# EasyEDA Pro project ProDoc_PCB1_2025-12-02.epro

# Board PCB1
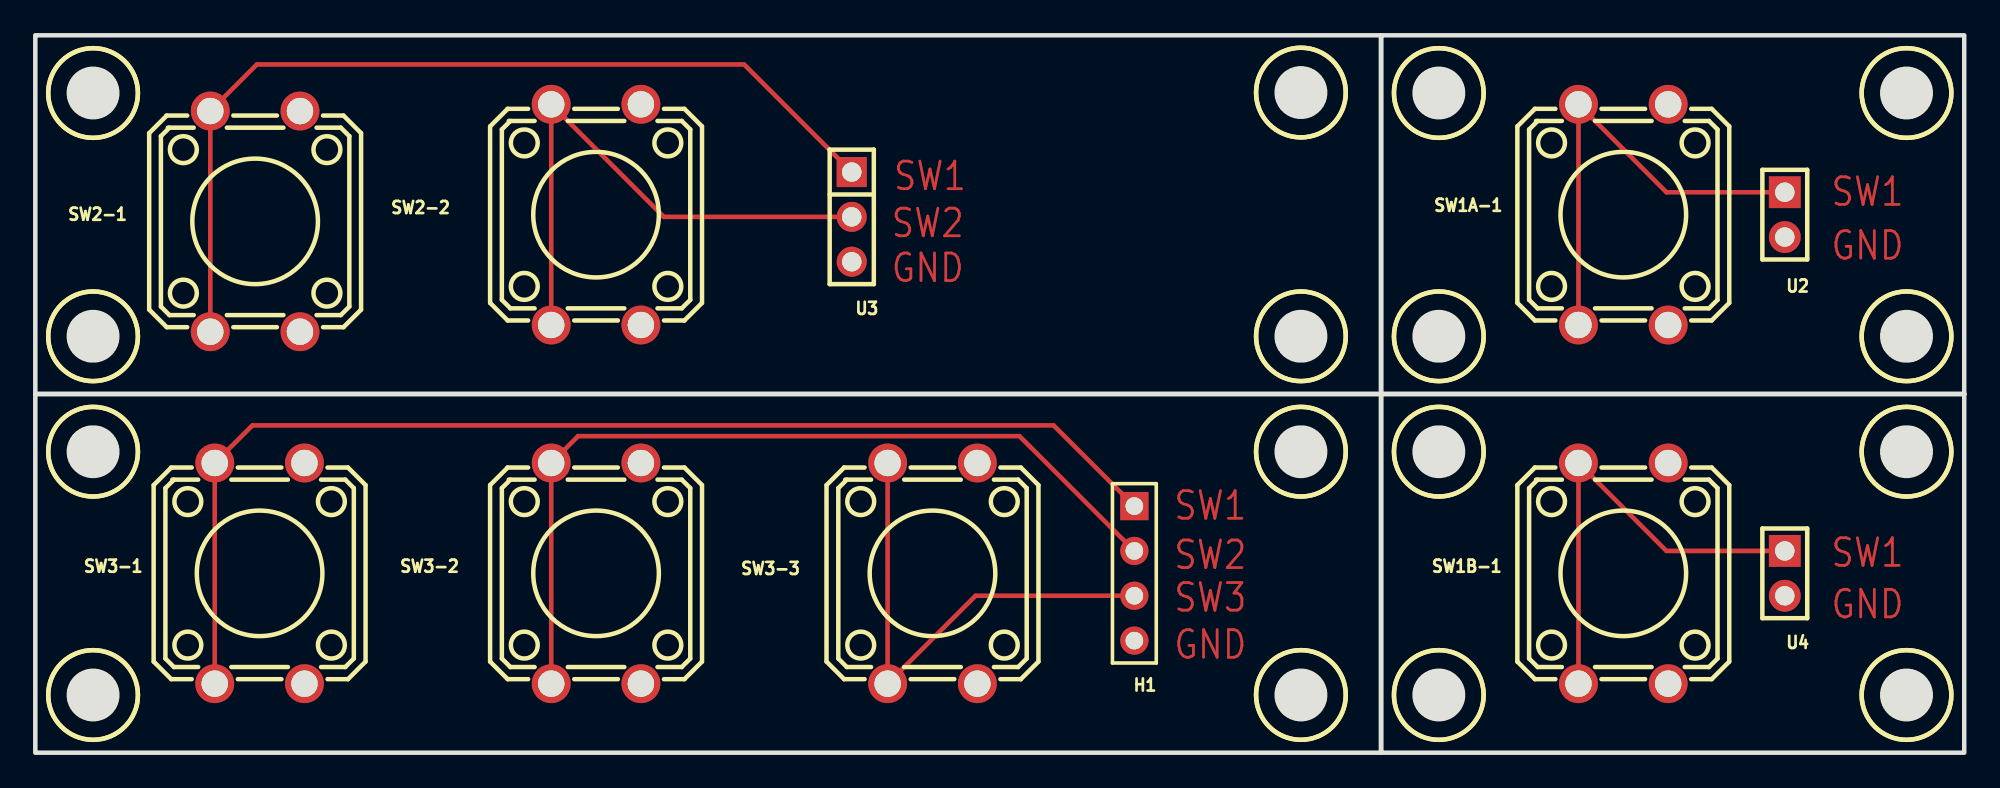
[diagram p0: board, top side]
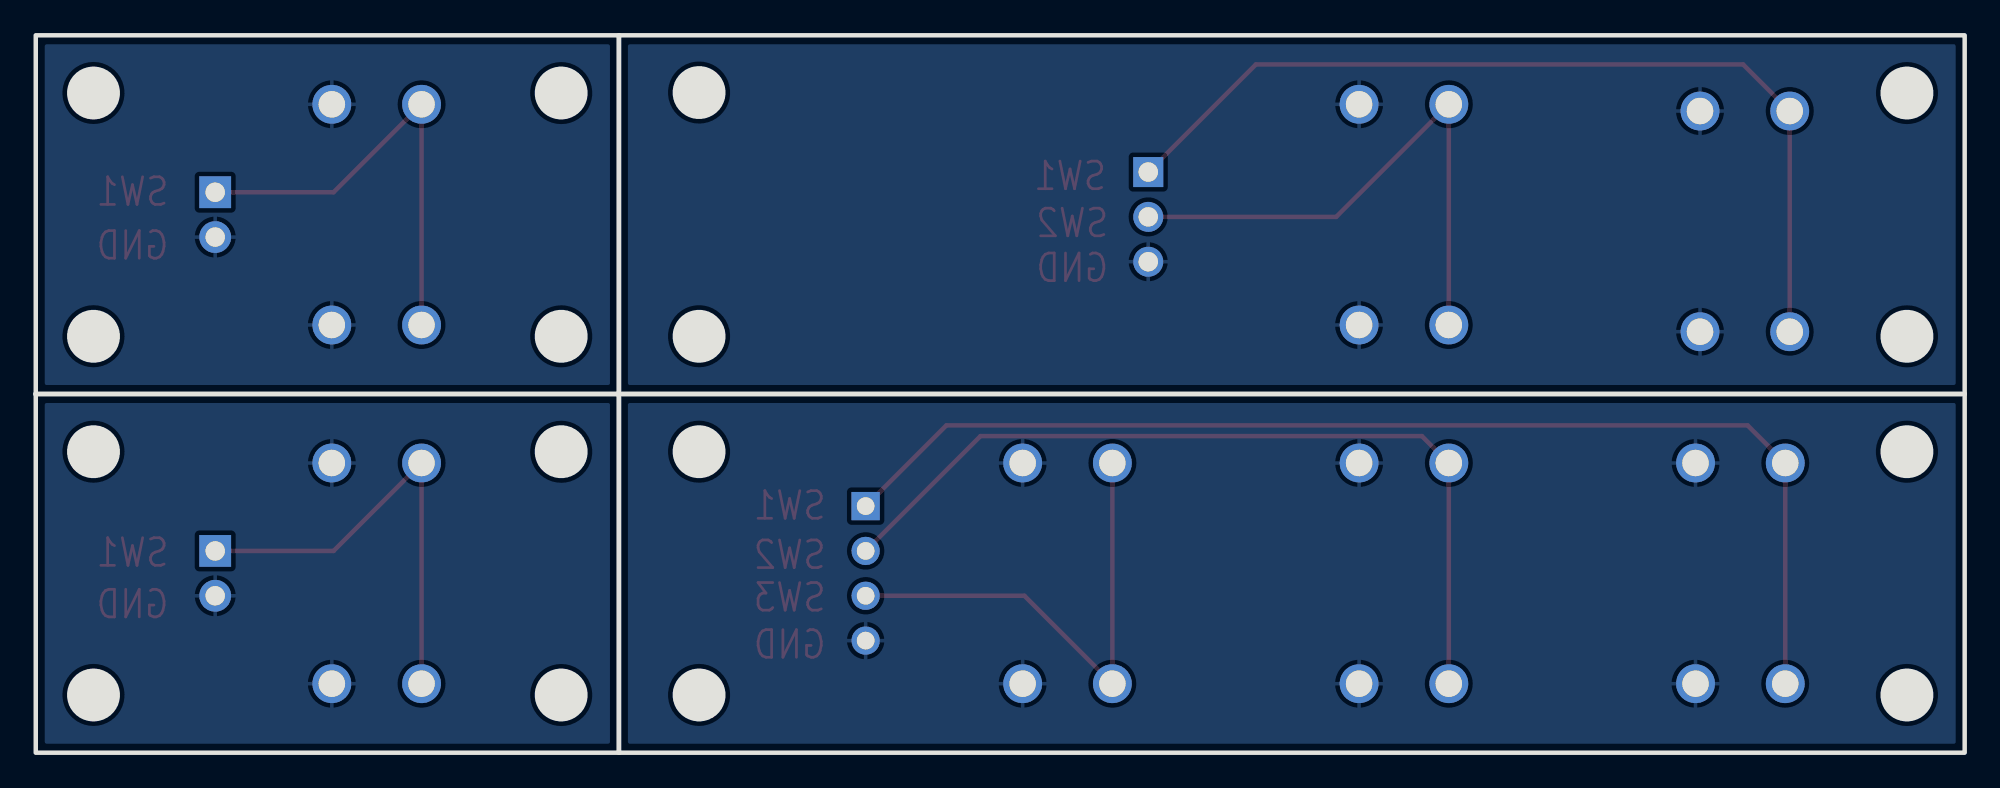
[diagram p1: board, bottom side, seen from below]

Outline 109.25 x 40.64 mm; copper layers: Top Layer, Bottom Layer. Coordinates in mm from the lower left corner of the outline.
Outline path: rectangle 0,40.64 109.22,0 ; rectangle 0,20.32 109.22,20.32 ; rectangle 76.2,40.64 76.2,0 ; 0,20.32 109.25,20.32 ; 76.2,40.64 76.2,0
Stack: Top Layer 0.035mm / Dielectric1 1.51mm FR4 er 4.5 / Bottom Layer 0.035mm

## Design rules (mm)
template: JLCPCB Capability(Two Layers Board)
spacing copperThickness1oz (default): track to track 0.102, other pairs 0.152 to 0.3
spacing copperThickness2oz: track to track 0.203, other pairs 0.152 to 0.3
track width copperThickness1oz (default): min 0.127, default 0.254, max 2.54
track width copperThickness2oz: min 0.203, default 0.254, max 2.54
differential pair differentialPair (default): width min 0.127, default 0.254, max 2.54; gap min 0.152, default 0.152
via viaSize (default): diameter min 0.5, default 0.61, max 10; hole min 0.3, default 0.305, max 6.3
pour e35 uses copperRegion
pour e103 uses copperRegion
pour e417 uses copperRegion
pour e535 uses copperRegion

## Placement (name value [footprint] x y rotation side)
1A-H1  1A-H1  [MOUNTING_HOLE_3MM]  79.47 23.59 0 top
1A-H2  1A-H2  [MOUNTING_HOLE_3MM]  79.47 37.37 0 top
1A-H3  1A-H3  [MOUNTING_HOLE_3MM]  105.95 37.37 0 top
1A-H4  1A-H4  [MOUNTING_HOLE_3MM]  105.95 23.59 0 top
1B-H1  1B-H1  [MOUNTING_HOLE_3MM]  79.47 3.27 0 top
1B-H2  1B-H2  [MOUNTING_HOLE_3MM]  105.95 3.27 0 top
1B-H3  1B-H3  [MOUNTING_HOLE_3MM]  79.47 17.05 0 top
1B-H4  1B-H4  [MOUNTING_HOLE_3MM]  105.95 17.05 0 top
2-H1  2-H1  [MOUNTING_HOLE_3MM]  3.27 23.59 0 top
2-H2  2-H2  [MOUNTING_HOLE_3MM]  3.27 37.37 0 top
2-H3  2-H3  [MOUNTING_HOLE_3MM]  71.66 37.4 0 top
2-H4  2-H4  [MOUNTING_HOLE_3MM]  71.66 23.59 0 top
3-H1  3-H1  [MOUNTING_HOLE_3MM]  3.27 3.27 0 top
3-H2  3-H2  [MOUNTING_HOLE_3MM]  3.27 17.05 0 top
3-H3  3-H3  [MOUNTING_HOLE_3MM]  71.66 3.27 0 top
3-H4  3-H4  [MOUNTING_HOLE_3MM]  71.66 17.05 0 top
H1  MTLW-104-05-G-S-213  [HDR-TH_4P-P2.54_MTLW-104-05-G-S-165]  62.23 10.16 90 top
SW1A-1  TS1213CJ 250gf 009  [KEY-TH_4P-L12.0-W12.0-P5.00-LS12.5]  89.92 30.48 270 top
SW1B-1  TS1213CJ 250gf 009  [KEY-TH_4P-L12.0-W12.0-P5.00-LS12.5]  89.92 10.16 270 top
SW2-1  TS1213CJ 250gf 009  [KEY-TH_4P-L12.0-W12.0-P5.00-LS12.5]  12.45 30.1 270 top
SW2-2  TS1213CJ 250gf 009  [KEY-TH_4P-L12.0-W12.0-P5.00-LS12.5]  31.75 30.48 270 top
SW3-1  TS1213CJ 250gf 009  [KEY-TH_4P-L12.0-W12.0-P5.00-LS12.5]  12.7 10.16 270 top
SW3-2  TS1213CJ 250gf 009  [KEY-TH_4P-L12.0-W12.0-P5.00-LS12.5]  31.75 10.16 270 top
SW3-3  TS1213CJ 250gf 009  [KEY-TH_4P-L12.0-W12.0-P5.00-LS12.5]  50.8 10.16 270 top
U2  Jumper2B  [HDR-TH_2P-P2.54-V-M-1]  99.06 30.48 270 top
U3  2.54MM间距单排插针3P/高度11mm  [HDR-TH_3P-P2.54-V-M]  46.23 30.35 270 top
U4  Jumper2B  [HDR-TH_2P-P2.54-V-M-1]  99.06 10.16 270 top

## Footprints (pads in the part's own frame, mm; a bottom-side part is the same pattern mirrored in y, then rotated)
HDR-TH_2P-P2.54-V-M-1
  rect 1.8x1.8 hole 1.1: 1(-1.27,0)
  round 1.8 hole 1.1: 2(1.27,0)
HDR-TH_3P-P2.54-V-M
  rect 1.7x1.7 hole 1.1: 1(-2.54,0)
  round 1.7 hole 1.1: 2(0,0) 3(2.54,0)
HDR-TH_4P-P2.54_MTLW-104-05-G-S-165
  rect 1.6x1.6 hole 1: 1(3.81,0)
  round 1.6 hole 1: 2(1.27,0) 3(-1.27,0) 4(-3.81,0)
KEY-TH_4P-L12.0-W12.0-P5.00-LS12.5
  round 2.2 hole 1.5: 1(-6.251,2.54) 2(6.251,2.54) 3(-6.251,-2.54) 4(6.251,-2.54)

## Nets
GND1A: SW1A-1.1 SW1A-1.2 U2.2
GND1B: SW1B-1.1 SW1B-1.2 U4.2
GND2: SW2-1.1 SW2-1.2 SW2-2.1 SW2-2.2 U3.3
GND3: H1.4 SW3-1.1 SW3-1.2 SW3-2.1 SW3-2.2 SW3-3.1 SW3-3.2
SW1A-1_IN: SW1A-1.3 SW1A-1.4 U2.1
SW1B-1_IN: SW1B-1.3 SW1B-1.4 U4.1
SW2-1_IN: SW2-1.3 SW2-1.4 U3.1
SW2-2_IN: SW2-2.3 SW2-2.4 U3.2
SW3-1_IN: H1.1 SW3-1.3 SW3-1.4
SW3-2_IN: H1.2 SW3-2.3 SW3-2.4
SW3-3_IN: H1.3 SW3-3.3 SW3-3.4

## Routing (per net, layer and track width the routed paths; a pad name or vN(x,y) marks a point on that pad's centre or on a via; arc(x,y) is an arc through that point)
SW1A-1_IN: length 26.2
  Top Layer w0.254: U2.1 92.36,31.75 SW1A-1.3 SW1A-1.4
SW1B-1_IN: length 26.2
  Top Layer w0.254: SW1B-1.4 SW1B-1.3 92.36,11.43 U4.1
SW2-1_IN: length 52.4
  Top Layer w0.254: SW2-1.4 SW2-1.3 12.55,38.99 40.13,38.99 U3.1
SW2-2_IN: length 32.2
  Top Layer w0.254: U3.2 35.59,30.35 SW2-2.3 SW2-2.4
SW3-1_IN: length 67.3
  Top Layer w0.254: H1.1 57.66,18.54 12.29,18.54 SW3-1.3 SW3-1.4
SW3-2_IN: length 48.8
  Top Layer w0.254: H1.2 55.72,17.94 30.73,17.94 SW3-2.3 SW3-2.4
SW3-3_IN: length 28.5
  Top Layer w0.254: H1.3 53.24,8.89 SW3-3.4 SW3-3.3

## Copper pours and planes (outline as drawn; the poured copper is in the pictures)
GND1A on Bottom Layer: 76.71,40.13 108.71,40.13 108.71,20.83 76.71,20.83
GND1B on Bottom Layer: 76.71,19.81 108.71,19.81 108.71,0.51 76.71,0.51
GND2 on Bottom Layer: 0.51,40.13 75.69,40.13 75.69,20.83 0.51,20.83
GND3 on Bottom Layer: 0.51,19.81 75.69,19.81 75.69,0.51 0.51,0.51

## Text on the board
Mechanical Layer: V-CUT
Top Layer: SW2 | GND | SW1 | SW3
